# Altium schematic sheet sch2.SchDoc
size 420 x 297 mm; Address1: Address1; Address2: Address2; Address3: Address3; Address4: Address4; DocumentNumber: АБВГ.123456.001 Э3; SheetNumber: 1; Scale: 1:1; DocumentType: Схема электрическая принципиальная; FirstReferrence: АБВГ.123456.001
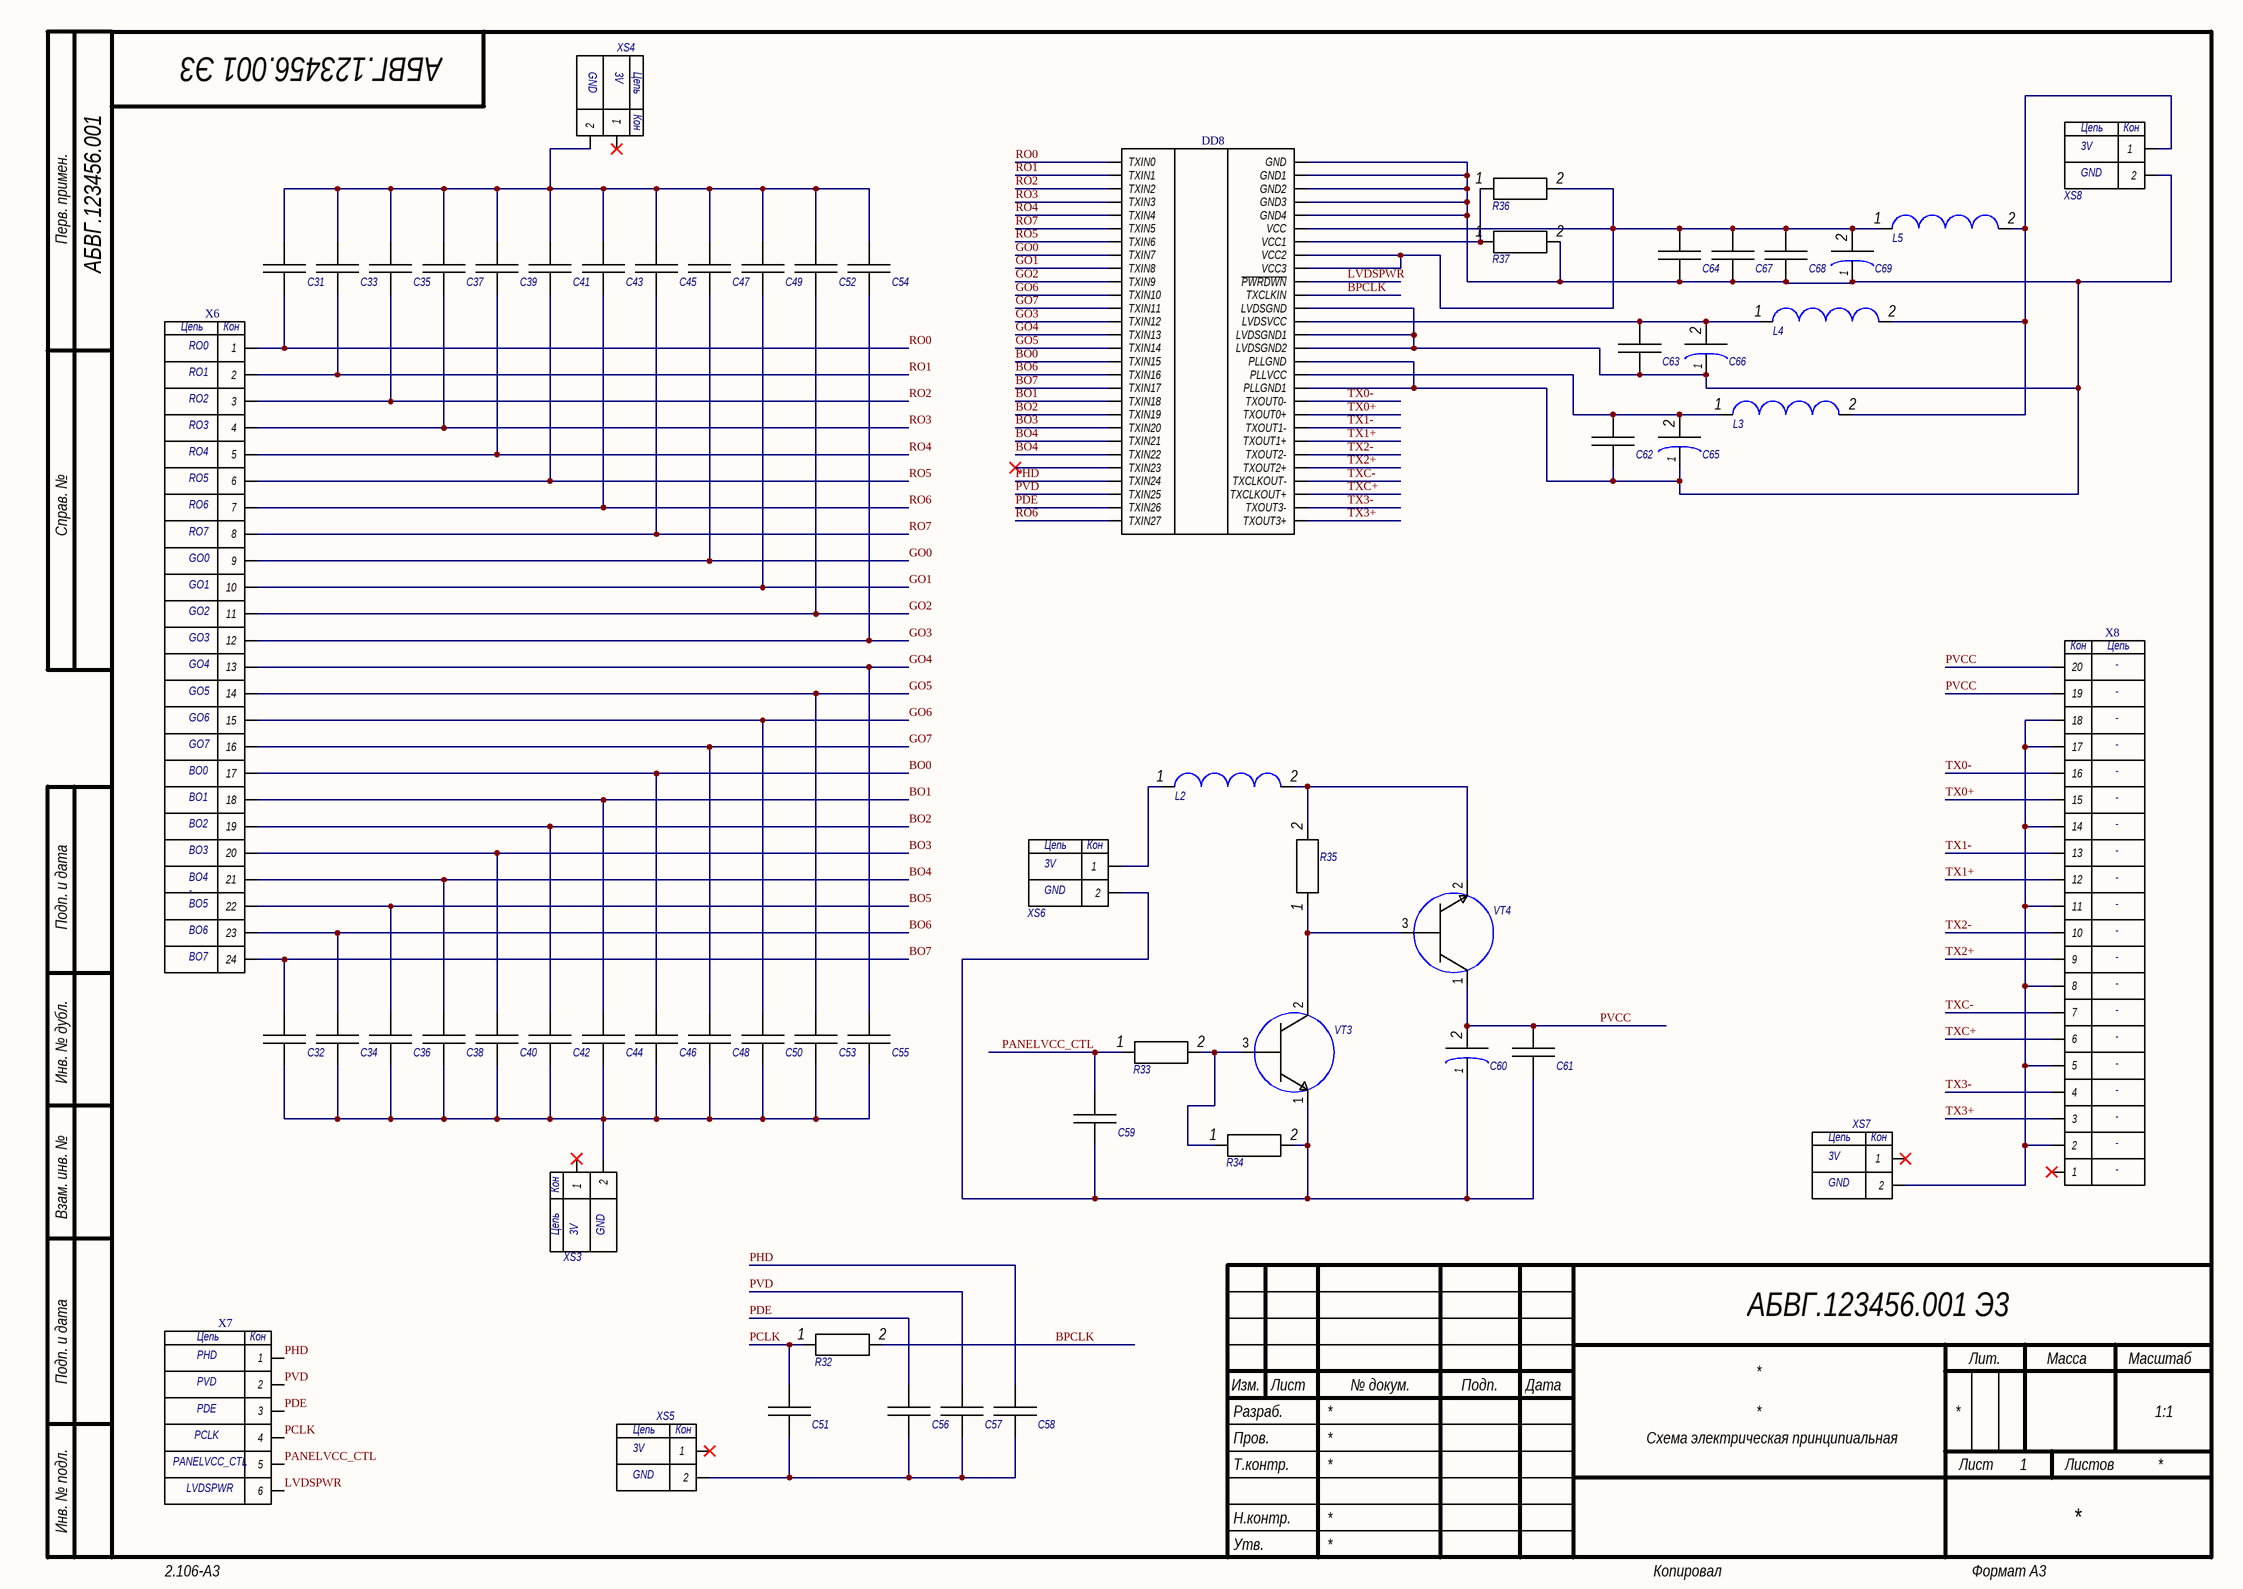
[diagram p0: sch2.SchDoc]

## Parts
C31  Capacitor  [cap(0603)]  (value not drawn)
C32  Capacitor  [cap(0603)]  (value not drawn)
C33  Capacitor  [cap(0603)]  (value not drawn)
C34  Capacitor  [cap(0603)]  (value not drawn)
C35  Capacitor  [cap(0603)]  (value not drawn)
C36  Capacitor  [cap(0603)]  (value not drawn)
C37  Capacitor  [cap(0603)]  (value not drawn)
C38  Capacitor  [cap(0603)]  (value not drawn)
C39  Capacitor  [cap(0603)]  (value not drawn)
C40  Capacitor  [cap(0603)]  (value not drawn)
C41  Capacitor  [cap(0603)]  (value not drawn)
C42  Capacitor  [cap(0603)]  (value not drawn)
C43  Capacitor  [cap(0603)]  (value not drawn)
C44  Capacitor  [cap(0603)]  (value not drawn)
C45  Capacitor  [cap(0603)]  (value not drawn)
C46  Capacitor  [cap(0603)]  (value not drawn)
C47  Capacitor  [cap(0603)]  (value not drawn)
C48  Capacitor  [cap(0603)]  (value not drawn)
C49  Capacitor  [cap(0603)]  (value not drawn)
C50  Capacitor  [cap(0603)]  (value not drawn)
C51  Capacitor  [cap(0603)]  (value not drawn)
C52  Capacitor  [cap(0603)]  (value not drawn)
C53  Capacitor  [cap(0603)]  (value not drawn)
C54  Capacitor  [cap(0603)]  (value not drawn)
C55  Capacitor  [cap(0603)]  (value not drawn)
C56  Capacitor  [cap(0603)]  (value not drawn)
C57  Capacitor  [cap(0603)]  (value not drawn)
C58  Capacitor  [cap(0603)]  (value not drawn)
C59  Capacitor  [cap(0603)]  (value not drawn)
C60  *  [Capacitor 0805]  (value not drawn)
C61  Capacitor  [cap(0603)]  (value not drawn)
C62  Capacitor  [cap(0603)]  (value not drawn)
C63  Capacitor  [cap(0603)]  (value not drawn)
C64  Capacitor  [cap(0603)]  (value not drawn)
C65  *  [Capacitor 0805]  (value not drawn)
C66  *  [Capacitor 0805]  (value not drawn)
C67  Capacitor  [cap(0603)]  (value not drawn)
C68  Capacitor  [cap(0603)]  (value not drawn)
C69  *  [Capacitor 0805]  (value not drawn)
DD8  *  [THC63]  (value not drawn)
L2  *  [Inductor 2520]  (value not drawn)
L3  *  [Inductor 2520]  (value not drawn)
L4  *  [Inductor 2520]  (value not drawn)
L5  *  [Inductor 2520]  (value not drawn)
R32  *  [Resistor 1206]  (value not drawn)
R33  *  [Resistor 1206]  (value not drawn)
R34  *  [Resistor 1206]  (value not drawn)
R35  *  [Resistor 1206]  (value not drawn)
R36  *  [Resistor 1206]  (value not drawn)
R37  *  [Resistor 1206]  (value not drawn)
VT3  *  [Transistor 1]  (value not drawn)
VT4  *  [Transistor 1]  (value not drawn)
X6  *  [BUSES]  (value not drawn)
X7  *  [Inputs]  (value not drawn)
X8  *  [DF14A]  (value not drawn)
XS3  *  [VCC-GND]  (value not drawn)
XS4  *  [VCC-GND]  (value not drawn)
XS5  *  [VCC-GND]  (value not drawn)
XS6  *  [VCC-GND]  (value not drawn)
XS7  *  [VCC-GND]  (value not drawn)
XS8  *  [VCC-GND]  (value not drawn)

## Nets
BO0: C46.2 DD8.16(TXIN15) X6.17
BO1: C44.2 DD8.19(TXIN18) X6.18
BO2: C42.2 DD8.20(TXIN19) X6.19
BO3: C40.2 DD8.21(TXIN20) X6.20
BO4: C38.2 DD8.22(TXIN21) DD8.23(TXIN22) X6.21
BO5: C36.2 X6.22
BO6: C34.2 DD8.17(TXIN16) X6.23
BO7: C32.2 DD8.18(TXIN17) X6.24
BPCLK: DD8.46(TXCLKIN) R32.2
GO0: C47.1 DD8.8(TXIN7) X6.9
GO1: C49.1 DD8.9(TXIN8) X6.10
GO2: C52.1 DD8.10(TXIN9) X6.11
GO3: C54.1 DD8.13(TXIN12) X6.12
GO4: C55.2 DD8.14(TXIN13) X6.13
GO5: C53.2 DD8.15(TXIN14) X6.14
GO6: C50.2 DD8.11(TXIN10) X6.15
GO7: C48.2 DD8.12(TXIN11) X6.16
LVDSPWR: DD8.47(~{PWRDWN}) X7.6
PANELVCC_CTL: C59.2 R33.1 X7.5
PCLK: C51.2 R32.1 X7.4
PDE: C56.2 DD8.27(TXIN26) X7.3
PHD: C58.2 DD8.25(TXIN24) X7.1
PVCC: C60.2 C61.2 VT4.1(KOLLECTOR) X8.19 X8.20
PVD: C57.2 DD8.26(TXIN25) X7.2
RO0: C31.1 DD8.1(TXIN0) X6.1
RO1: C33.1 DD8.2(TXIN1) X6.2
RO2: C35.1 DD8.3(TXIN2) X6.3
RO3: C37.1 DD8.4(TXIN3) X6.4
RO4: C39.1 DD8.5(TXIN4) X6.5
RO5: C41.1 DD8.7(TXIN6) X6.6
RO6: C43.1 DD8.28(TXIN27) X6.7
RO7: C45.1 DD8.6(TXIN5) X6.8
TX0+: DD8.37(TXOUT0+) X8.15
TX0-: DD8.38(TXOUT0-) X8.16
TX1+: DD8.35(TXOUT1+) X8.12
TX1-: DD8.36(TXOUT1-) X8.13
TX2+: DD8.33(TXOUT2+) X8.9
TX2-: DD8.34(TXOUT2-) X8.10
TX3+: DD8.29(TXOUT3+) X8.3
TX3-: DD8.30(TXOUT3-) X8.4
TXC+: DD8.31(TXCLKOUT+) X8.6
TXC-: DD8.32(TXCLKOUT-) X8.7
NetC31_2: C31.2 C33.2 C35.2 C37.2 C39.2 C41.2 C43.2 C45.2 C47.2 C49.2 C52.2 C54.2 XS4.2
NetC32_1: C32.1 C34.1 C36.1 C38.1 C40.1 C42.1 C44.1 C46.1 C48.1 C50.1 C53.1 C55.1 XS3.2
NetC51_1: C51.1 C56.1 C57.1 C58.1 XS5.2
NetC59_1: C59.1 C60.1 C61.1 R34.2 VT3.1(KOLLECTOR) XS6.2
NetC62_1: C62.1 C63.1 C64.1 C65.1 C66.1 C67.1 C68.1 C69.1 DD8.39(PLLGND1) DD8.41(PLLGND) DD8.42(LVDSGND2) DD8.43(LVDSGND1) DD8.45(LVDSGND) DD8.52(GND4) DD8.53(GND3) DD8.54(GND2) DD8.55(GND1) DD8.56(GND) R37.2 XS8.2
NetC62_2: C62.2 C65.2 DD8.40(PLLVCC) L3.1
NetC63_2: C63.2 C66.2 DD8.44(LVDSVCC) L4.1
NetC64_2: C64.2 C67.2 C68.2 C69.2 DD8.48(VCC3) DD8.49(VCC2) DD8.51(VCC) L5.1 R36.2
NetDD8_50: DD8.50(VCC1) R36.1 R37.1
NetL2_1: L2.1 XS6.1
NetL2_2: L2.2 R35.2 VT4.2(EMITTER)
NetL3_2: L3.2 L4.2 L5.2 XS8.1
NetR33_2: R33.2 R34.1 VT3.3(BAZA)
NetR35_1: R35.1 VT3.2(EMITTER) VT4.3(BAZA)
NetX8_2: X8.2 X8.5 X8.8 X8.11 X8.14 X8.17 X8.18 XS7.2

Not connected (* = marked no-connect by the designer): DD8 24(TXIN23)*; X8 1*; XS3 1*; XS4 1*; XS5 1*; XS7 1*

## Notes on the sheet
- Перв. примен.
- Справ. №
- Подп. и дата
- Инв. № дубл.
- Взам. инв. №
- Разраб.
- Изм.
- Лист
- № докум.
- Подп.
- Дата
- Лит.
- Масса
- Масштаб
- Пров.
- Т.контр.
- Листов
- Инв. № подл.
- Утв.
- Н.контр.
- 2.106-A3
- Копировал
- Формат А3
- (in symbol BUSES) Цепь; Кон; RO0; RO1; RO2; RO3; RO4; RO5; RO6; RO7; GO0; GO1; GO2; GO3; GO4; GO5; GO6; GO7; BO0; BO1; BO2; BO3; BO4; -; BO5; BO6; BO7
- (in symbol DF14A) Кон; Цепь; -
- (in symbol Inputs) Цепь; Кон; PHD; PVD; PDE; PCLK; PANELVCC_CTL; LVDSPWR
- (in symbol VCC-GND R) GND; 3V; Цепь; Кон

## Library data of the parts
C60 C65 C66 C69 = Capacitor Duga: Model: *
DD8 = THC63
L2-L5 = Inductor: Model: *
R32-R37 = Resistor: Model: *
VT3 = Transistor 1
VT4 = Transistor 2_1
X6 = BUSES
X7 = Inputs
X8 = DF14A
XS3-XS8 = VCC-GND R
C31-C59 C61-C64 C67 C68 = Capacitor: Model: *